# Altium project ExpandBoardZero.PrjPcb
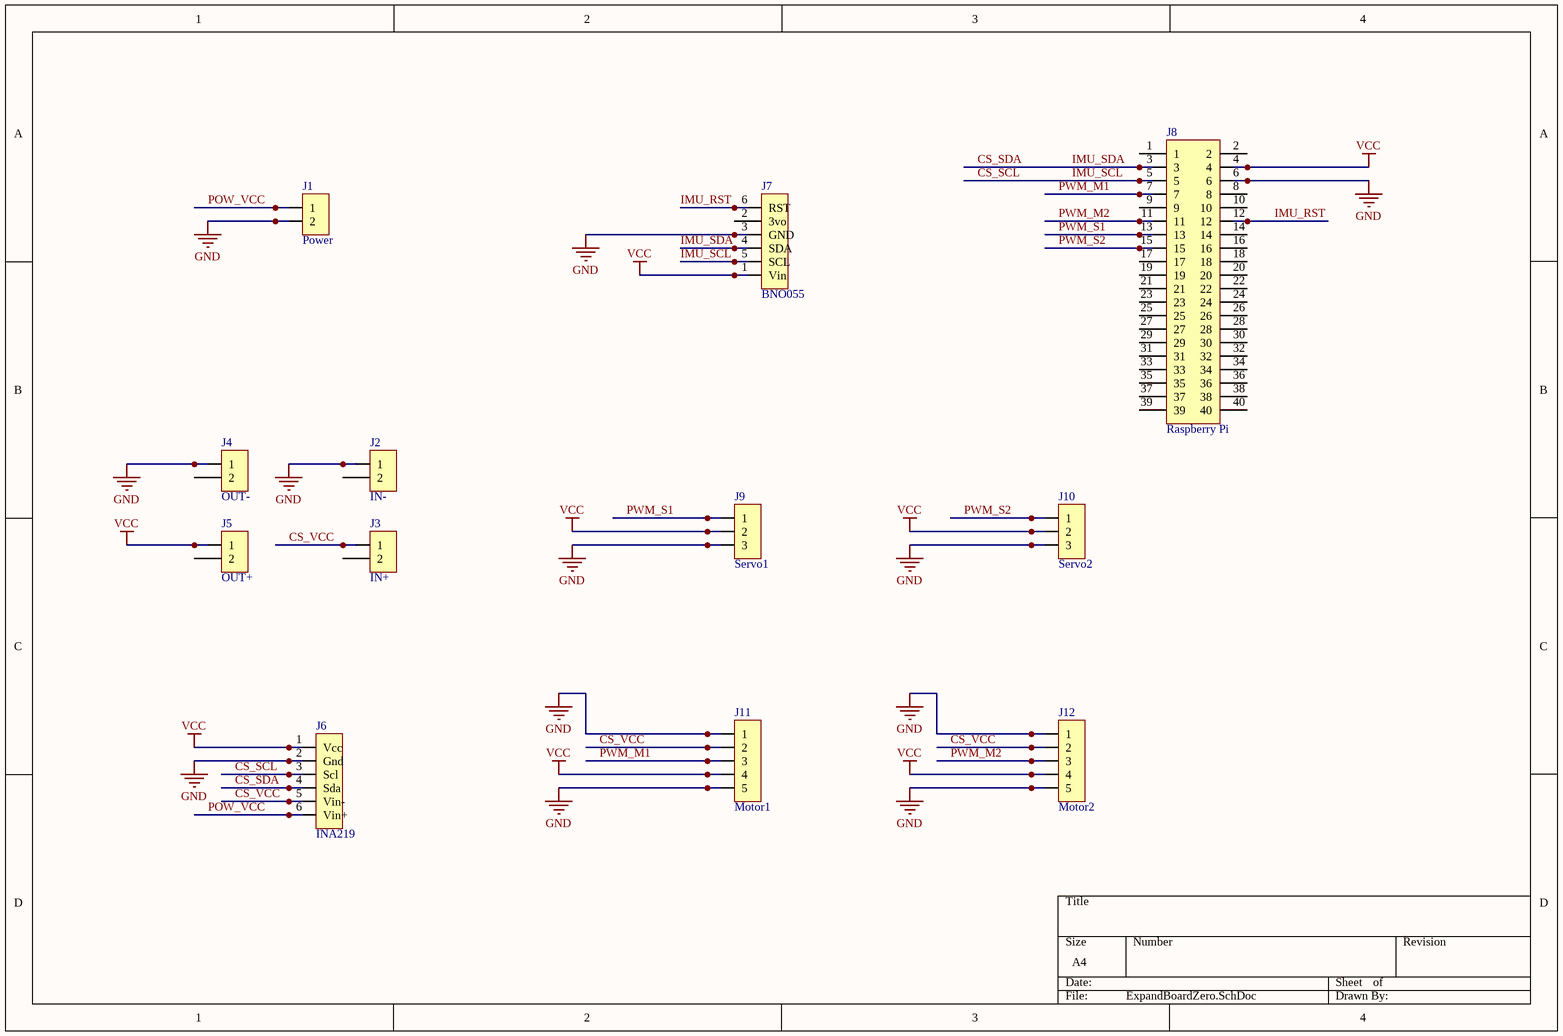
[diagram p0: ExpandBoardZero.SchDoc]
1 sheet, 12 parts. Net scope: global (net labels, ports and power ports of the same name join across sheets).
Board file: ExpandBoardZero.PcbDoc

## Sheet ExpandBoardZero.SchDoc
size A4

### Parts
J1  Power  [Pin HDR1X2/2.54mm-S]
J2  IN-  [Pin HDR1X2/2.54mm-S]
J3  IN+  [Pin HDR1X2/2.54mm-S]
J4  OUT-  [Pin HDR1X2/2.54mm-S]
J5  OUT+  [Pin HDR1X2/2.54mm-S]
J6  INA219  [Pin HDR1X6/2.54mm-S]
J7  BNO055  [Pin HDR1X6/2.54mm-S]
J8  Raspberry Pi  [Pin HDR2X20/2.54mm-S]
J9  Servo1  [Pin HDR1X3/2.54mm-S]
J10  Servo2  [Pin HDR1X3/2.54mm-S]
J11  Motor1  [Pin HDR1X5/2.54mm-S]
J12  Motor2  [Pin HDR1X5/2.54mm-S]

### Nets
GND: J1.2 J2.1 J4.1 J6.2(Gnd) J7.3(GND) J8.6 J9.3 J10.3 J11.1 J11.5 J12.1 J12.5
VCC: J5.1 J6.1(Vcc) J7.1(Vin) J8.4 J9.2 J10.2 J11.4 J12.4
CS_SCL: J6.3(Scl) J7.5(SCL) J8.5  [also labelled IMU_SCL]
CS_SDA: J6.4(Sda) J7.4(SDA) J8.3  [also labelled IMU_SDA]
CS_VCC: J3.1 J6.5(Vin-) J11.2 J12.2
IMU_RST: J7.6(RST) J8.12
POW_VCC: J1.1 J6.6(Vin+)
PWM_M1: J8.7 J11.3
PWM_M2: J8.11 J12.3
PWM_S1: J8.13 J9.1
PWM_S2: J8.15 J10.1

Not connected (* = marked no-connect by the designer): J2 2; J3 2; J4 2; J5 2; J7 2(3vo); J8 1 2 8 9 10 14 16 17 18 19 20 21 22 23 24 25 26 27 28 29 30 31 32 33 34 35 36 37 38 39 40

### Library data of the parts
J1-J5 = Pin HDR1X2
J6 J7 = Pin HDR1X6
J8 = Pin HDR2X20
J9 J10 = Pin HDR1X3
J11 J12 = Pin HDR1X5